# Altium schematic sheet V3(B0317).SchDoc
size A2
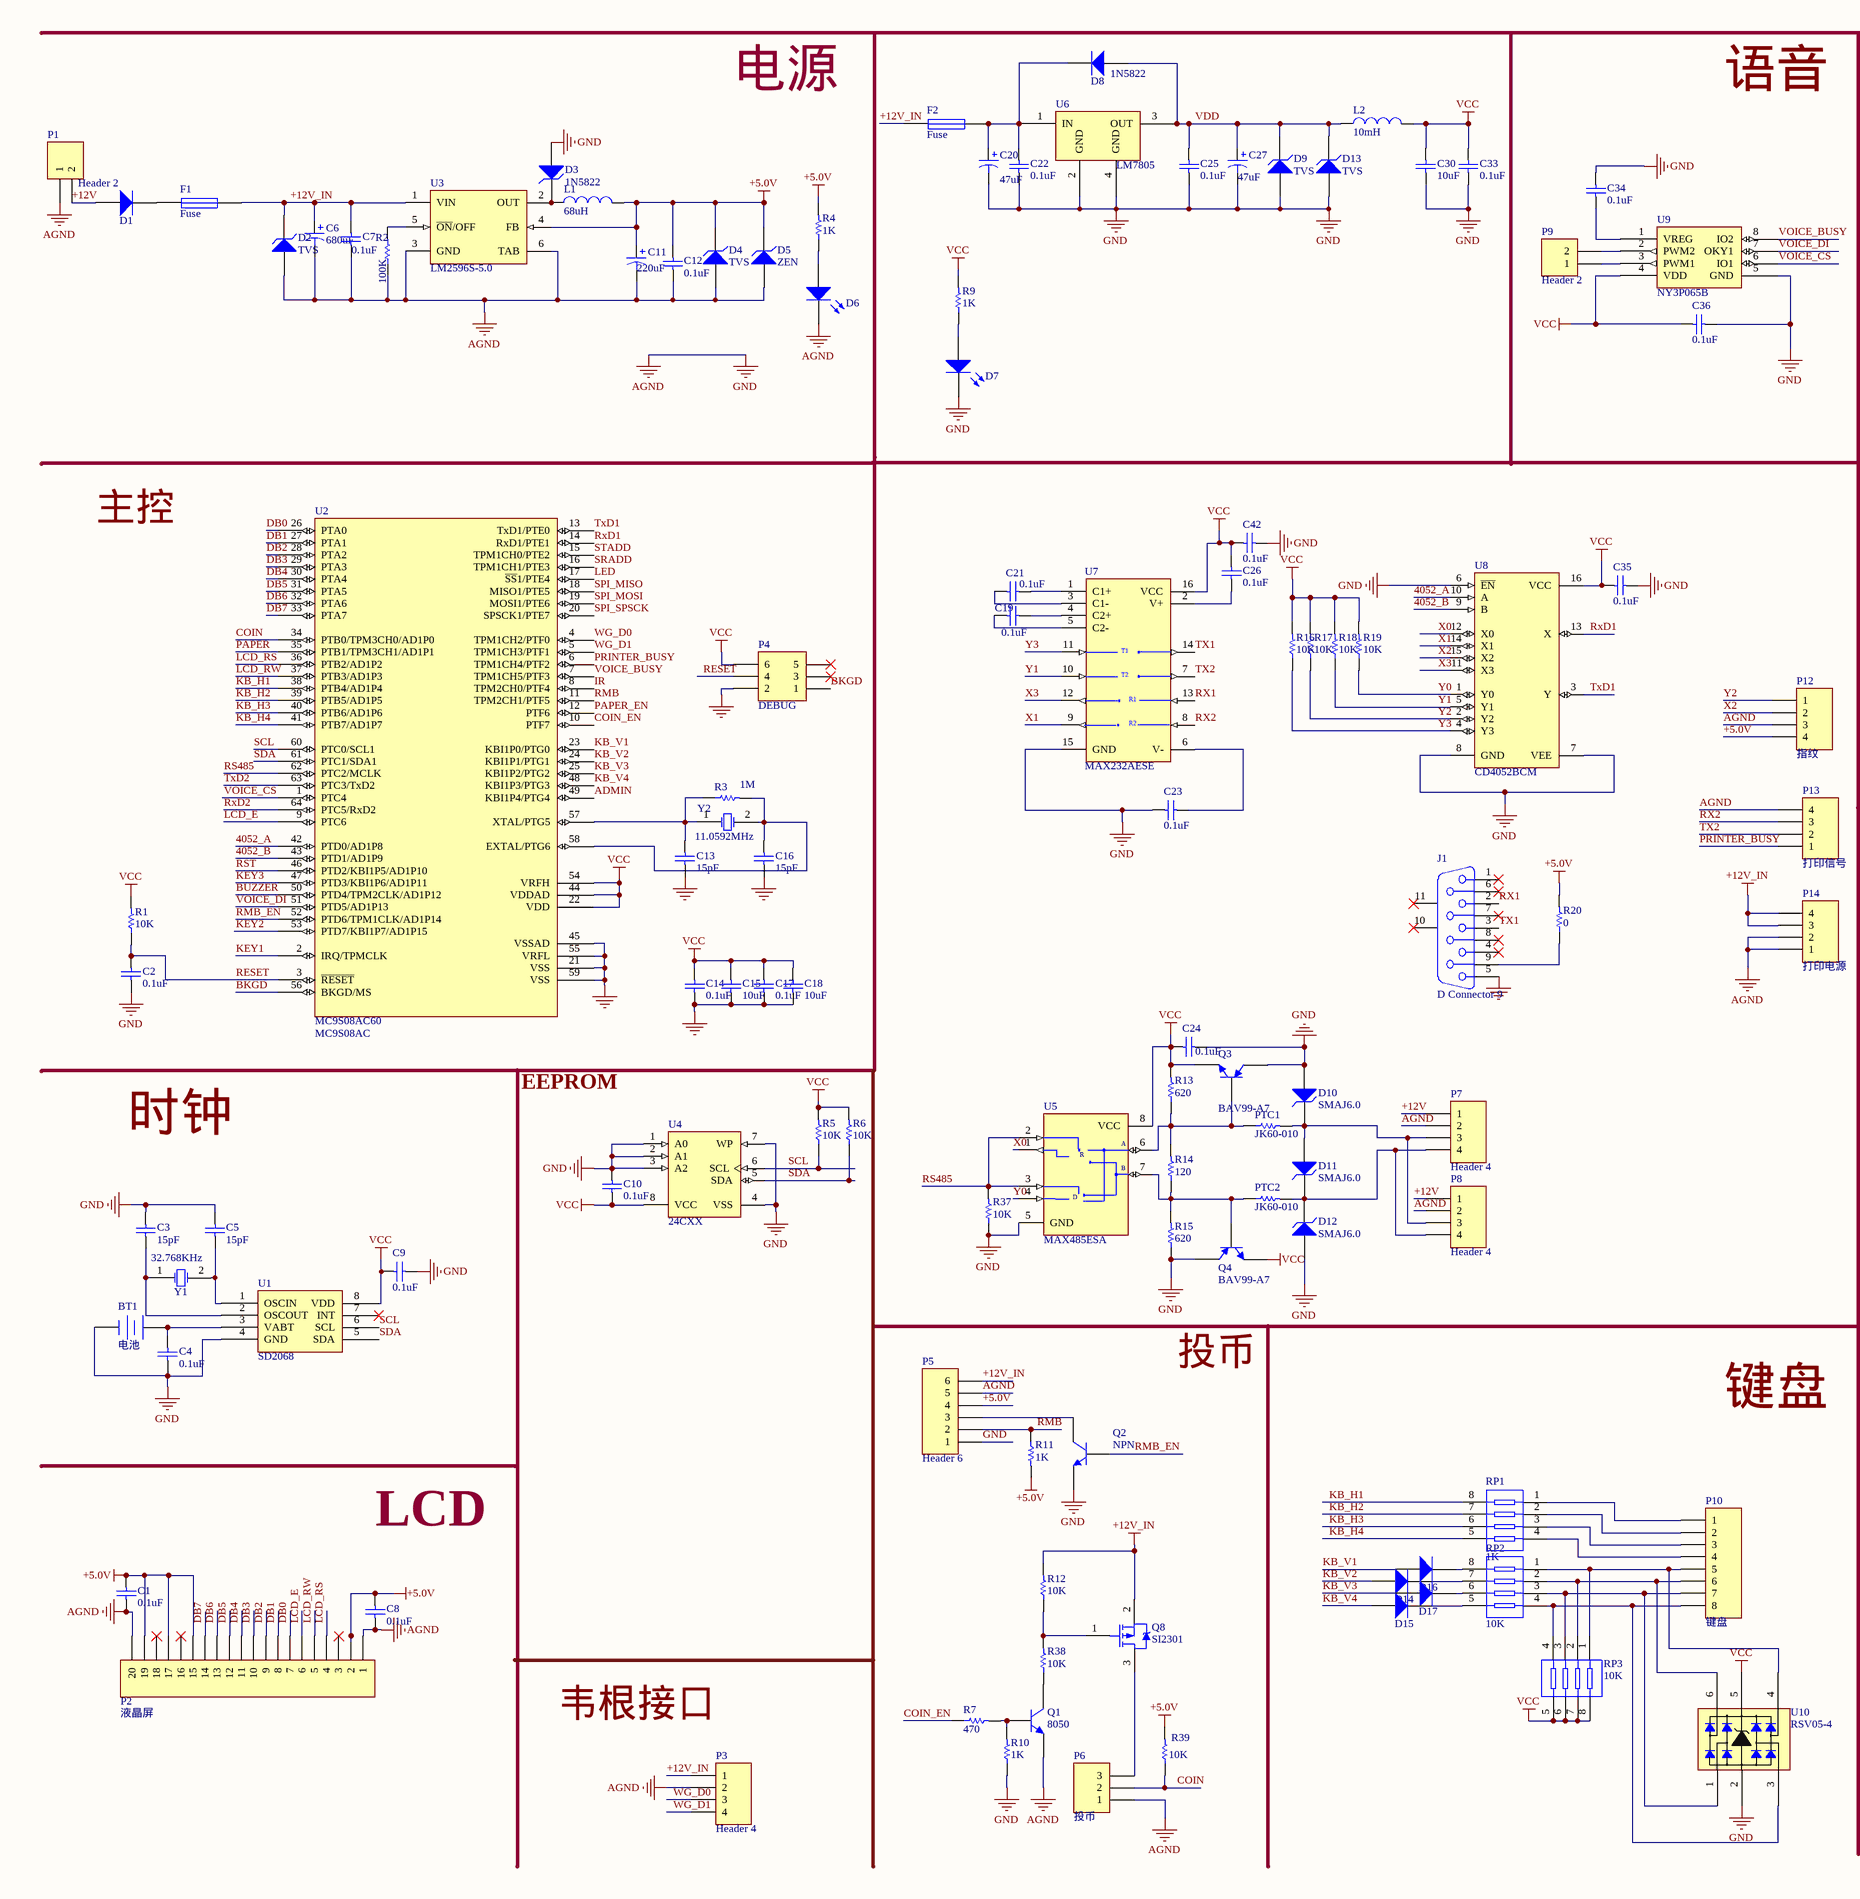
[diagram p0: V3(B0317).SchDoc, left]
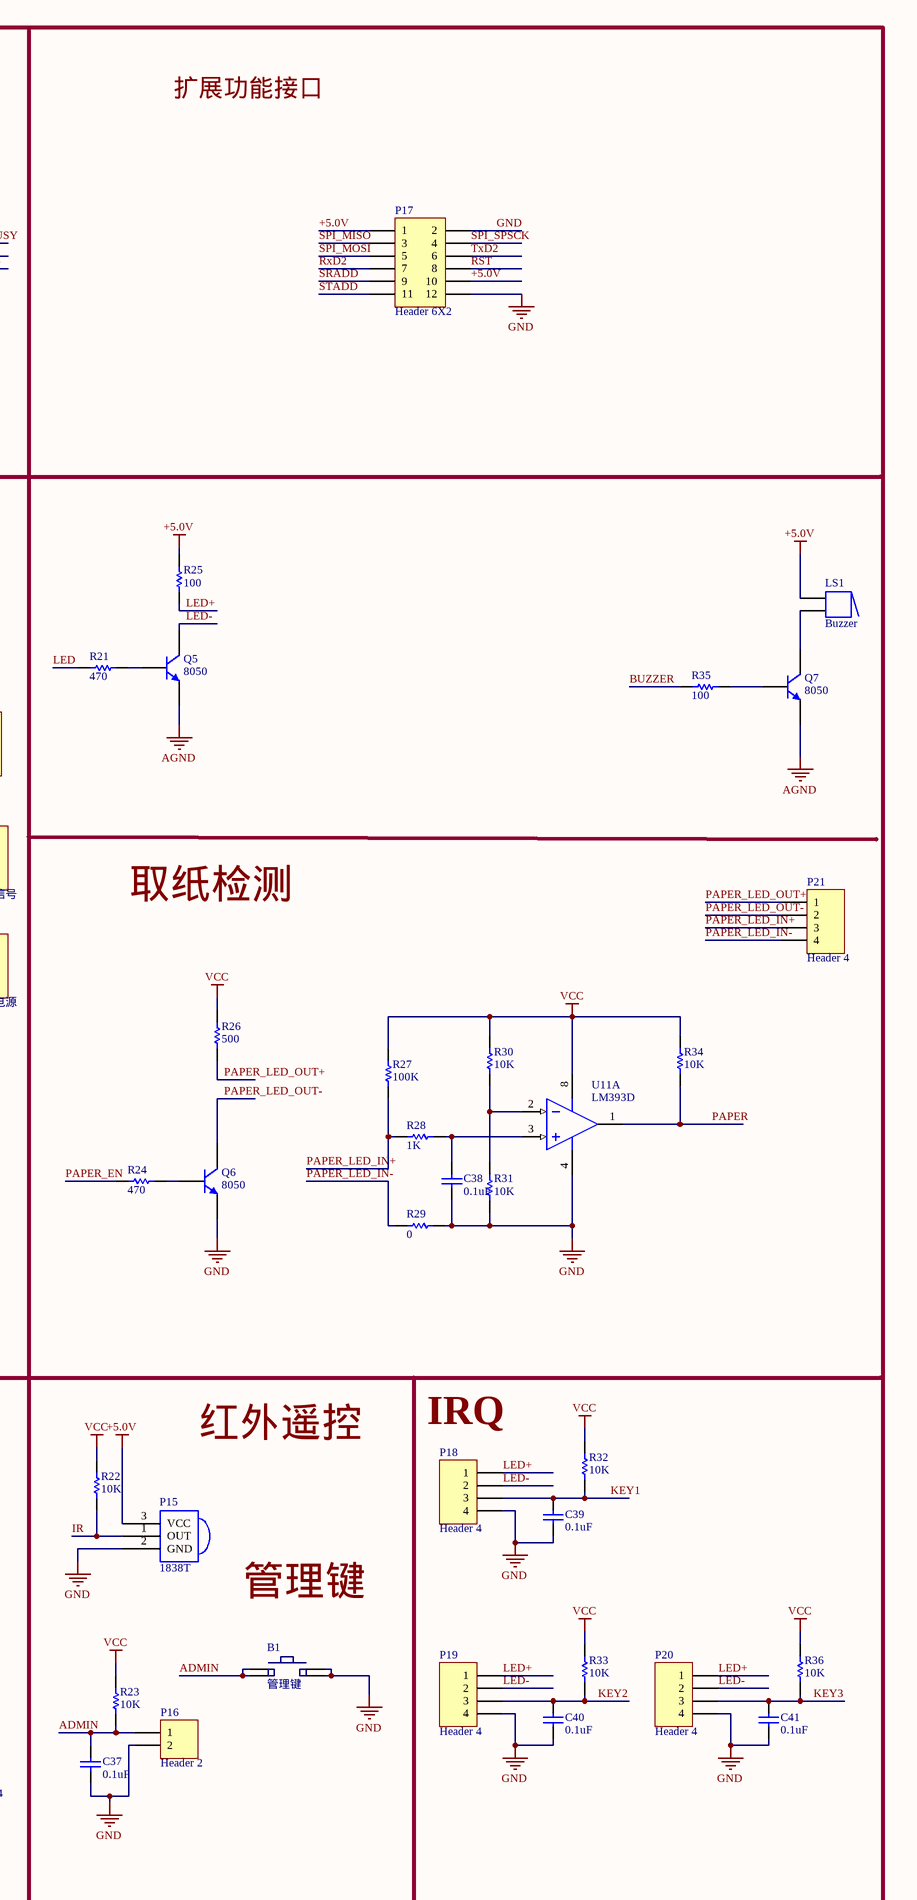
[diagram p1: V3(B0317).SchDoc, right]

## Parts
B1  管理键  [AN66]
BT1  电池  [CR1220]
C1  0.1uF  [CAPC2012M]
C2  0.1uF  [CAPC2012M]
C3  15pF  [CAPC2012M]
C4  0.1uF  [CAPC2012M]
C5  15pF  [CAPC2012M]
C6  value 680uF  [CAPPR2-5x11.5]  (hidden comment: Cap Pol2)
C7  0.1uF  [CAPC2012M]
C8  0.1uF  [CAPC2012M]
C9  0.1uF  [CAPC2012M]
C10  0.1uF  [CAPC2012M]
C11  value 220uF  [CAPPR2-5x11.5]  (hidden comment: Cap Pol2)
C12  0.1uF  [CAPC2012M]
C13  15pF  [CAPC2012M]
C14  0.1uF  [CAPC2012M]
C15  10uF  [CAPC2012M]
C16  15pF  [CAPC2012M]
C17  0.1uF  [CAPC2012M]
C18  10uF  [CAPC2012M]
C19  0.1uF  [CAPC2012M]
C20  value 47uF  [CAPPR2-5x11.5]  (hidden comment: Cap Pol2)
C21  0.1uF  [CAPC2012M]
C22  0.1uF  [CAPC2012M]
C23  0.1uF  [CAPC2012M]
C24  0.1uF  [CAPC2012M]
C25  0.1uF  [CAPC2012M]
C26  0.1uF  [CAPC2012M]
C27  value 47uF  [CAPPR2-5x11.5]  (hidden comment: Cap Pol2)
C30  10uF  [CAPC2012M]
C33  0.1uF  [CAPC2012M]
C34  0.1uF  [CAPC2012M]
C35  0.1uF  [CAPC2012M]
C36  0.1uF  [CAPC2012M]
C37  0.1uF  [CAPC2012M]
C38  0.1uF  [CAPC2012M]
C39  0.1uF  [CAPC2012M]
C40  0.1uF  [CAPC2012M]
C41  0.1uF  [CAPC2012M]
C42  0.1uF  [CAPC2012M]
D1  Diode  [DSO-C2/X1.8]  (value not drawn)
D2  TVS  [DSO-C2/X1.8]
D3  1N5822  [DSO-C2/X1.8]
D4  TVS  [DSO-C2/X1.8]
D5  ZEN  [DIO1206]
D6  LED  [LED2012M]  (value not drawn)
D7  LED  [LED2012M]  (value not drawn)
D8  1N5822  [DSO-C2/X1.8]
D9  TVS  [DSO-C2/X1.8]
D10  SMAJ6.0  [DSO-C2/X1.8]
D11  SMAJ6.0  [DSO-C2/X1.8]
D12  SMAJ6.0  [DSO-C2/X1.8]
D13  TVS  [DIO1206]
D14  1N4007  [SOD123]  (value not drawn)
D15  1N4007  [SOD123]  (value not drawn)
D16  1N4007  [SOD123]  (value not drawn)
D17  1N4007  [SOD123]  (value not drawn)
F1  Fuse  [SR075]
F2  Fuse  [FUSE1206N]
J1  D Connector 9  [DSUB1.385-2H9]
L1  value 68uH  [INDUCTOR-9*12]  (hidden comment: Inductor)
L2  value 10mH  [INDC2012M]  (hidden comment: Inductor)
LS1  Buzzer  [BELL]
P1  Header 2  [VH396-2]
P2  液晶屏  [LCD12864]
P3  Header 4  [XH254-4]
P4  DEBUG  [HDR2X3]
P5  Header 6  [XH254-6]
P6  投币  [XH254-3]
P7  Header 4  [VH396-4]
P8  Header 4  [VH396-4]
P9  Header 2  [XH254-2]
P10  键盘  [XH254-8]
P12  指纹  [XH254-4]
P13  打印信号  [XH254-4]
P14  打印电源  [XH254-4]
P15  1838T  [XH254-3]
P16  Header 2  [XH254-2]
P17  Header 6X2  [HDR2X6]
P18  Header 4  [XH254-4]
P19  Header 4  [XH254-4]
P20  Header 4  [XH254-4]
P21  Header 4  [XH254-4]
PTC1  JK60-010  [RESC2012M]
PTC2  JK60-010  [RESC2012M]
Q1  8050  [SOT23-3M]
Q2  NPN  [SOT23-3M]
Q3  BAV99-A7  [SOT23-3M]
Q4  BAV99-A7  [SOT23-3M]
Q5  8050  [SOT23-3M]
Q6  8050  [SOT23-3M]
Q7  8050  [SOT23-3M]
Q8  SI2301  [SOT23-3M]
R1  10K  [RESC2012M]
R2  100K  [RESC2012M]
R3  1M  [RESC2012M]
R4  1K  [RESC2012M]
R5  10K  [RESC2012M]
R6  10K  [RESC2012M]
R7  470  [RESC2012M]
R9  1K  [RESC2012M]
R10  1K  [RESC2012M]
R11  1K  [RESC2012M]
R12  10K  [RESC2012M]
R13  620  [RESC2012M]
R14  120  [RESC2012M]
R15  620  [RESC2012M]
R16  10K  [RESC2012M]
R17  10K  [RESC2012M]
R18  10K  [RESC2012M]
R19  10K  [RESC2012M]
R20  0  [RESC2012M]
R21  470  [RESC2012M]
R22  10K  [RESC2012M]
R23  10K  [RESC2012M]
R24  470  [RESC2012M]
R25  100  [RESC2012M]
R26  500  [RESC2012M]
R27  100K  [RESC2012M]
R28  1K  [RESC2012M]
R29  0  [RESC2012M]
R30  10K  [RESC2012M]
R31  10K  [RESC2012M]
R32  10K  [RESC2012M]
R33  10K  [RESC2012M]
R34  10K  [RESC2012M]
R35  100  [RESC2012M]
R36  10K  [RESC2012M]
R37  10K  [RESC2012M]
R38  10K  [RESC2012M]
R39  10K  [RESC2012M]
RP1  1K  [EXB38V]
RP2  10K  [EXB38V]
RP3  10K  [EXB38V]
U1  SD2068  [SO8_M]
U2  MC9S08AC60  value MC9S08AC  [QFP80P1720X1720-64N]
U3  LM2596S-5.0  [TS5B_N]
U4  24CXX  [SO8_M]
U5  MAX485ESA  [SO8_M]
U6  LM7805  [SOT223-4M]
U7  MAX232AESE  [SO16_M]
U8  CD4052BCM  [SO16_M]
U9  NY3P065B  [DIP-8]
U10  RSV05-4  [SOT26A-6M]
U11  LM393D  [SO8_M]  (part A of 2)
Y1  value 32.768KHz  [XTAL-W2/D2.1]  (hidden comment: XTAL)
Y2  value 11.0592MHz  [HC49_TH]  (hidden comment: XTAL)

## Nets
+5.0V: C1.2 C8.2 C11.1 C12.2 D4.2(K) D5.2(K) L1.2 LS1.1 P2.2 P2.15 P2.17 P2.19 P5.4 P12.4 P15.3(VCC) P17.1 P17.10 R4.2 R11.2 R20.2 R25.2 R39.2 U3.4(FB)
+12V_IN: C6.1 C7.2 D2.2(K) F1.2 F2.1 P3.1 P5.6 P14.3 P14.4 Q8.2(S) R12.2 U3.1(VIN)
AGND: B1.2 B1.4 BT1.2(-) C1.1 C2.1 C3.2 C4.1 C5.2 C6.2 C7.1 C8.1 C9.2 C10.2 C11.2 C12.1 C13.1 C14.1 C15.1 C16.1 C17.1 C18.1 C20.2 C22.1 C23.1 C24.2 C25.2 C27.2 C30.1 C33.1 C34.2 C35.2 C36.1 C37.1 C38.1 C39.1 C40.1 C41.1 C42.2 D2.1(A) D3.1(A) D4.1(A) D5.1(A) D6.2(K) D7.2(K) D9.1(A) D10.1(A) D12.1(A) D13.1(A) J1.5 P1.1 P2.1 P2.20 P3.2 P4.2 P5.1 P5.5 P6.1 P7.2 P8.2 P12.3 P13.4 P14.1 P14.2 P15.2(GND) P16.2 P17.2 P17.12 P18.4 P19.4 P20.4 Q1.2(E) Q2.2(E) Q3.1(C) Q4.1(C) Q5.2(E) Q6.2(E) Q7.2(E) R2.1 R10.1 R15.1 R29.2 R31.1 R37.1 U1.4(GND) U2.21(VSS) U2.45(VSSAD) U2.55(VRFL) U2.59(VSS) U3.3(GND) U3.6(TAB) U4.1(A0) U4.2(A1) U4.3(A2) U4.4(VSS) U4.7(WP) U5.5(GND) U6.2(GND) U6.4(GND) U7.15(GND) U8.6(~{EN}) U8.7(VEE) U8.8(GND) U9.5(GND) U10.2 U11.4(V-)  [also labelled GND]
VCC: C9.1 C10.1 C14.2 C15.2 C17.2 C18.2 C24.1 C26.2 C30.2 C33.2 C35.1 C36.2 C42.1 L2.2 P4.6 Q3.2(E) Q4.2(E) R1.2 R5.2 R6.2 R9.2 R13.2 R16.2 R17.2 R18.2 R19.2 R22.2 R23.2 R26.2 R27.2 R30.2 R32.2 R33.2 R34.2 R36.2 RP3.5 RP3.6 RP3.7 RP3.8 U1.8(VDD) U2.22(VDD) U2.44(VDDAD) U2.54(VRFH) U4.8(VCC) U5.8(VCC) U7.16(VCC) U8.16(VCC) U9.4(VDD) U10.5 U11.8(V+)
4052_A: U2.42(PTD0/AD1P8) U8.10(A)
4052_B: U2.43(PTD1/AD1P9) U8.9(B)
+12V: D1.1(A) P1.2 P7.1 P8.1
ADMIN: B1.1 B1.3 C37.2 P16.1 R23.1 U2.49(KBI1P4/PTG4)
BKGD: P4.1 U2.56(BKGD/MS)
BUZZER: R35.1 U2.50(PTD4/TPM2CLK/AD1P12)
COIN: P6.2 R39.1 U2.34(PTB0/TPM3CH0/AD1P0)
COIN_EN: R7.1 U2.10(PTF7)
DB0: P2.7 U2.26(PTA0)
DB1: P2.8 U2.27(PTA1)
DB2: P2.9 U2.28(PTA2)
DB3: P2.10 U2.29(PTA3)
DB4: P2.11 U2.30(PTA4)
DB5: P2.12 U2.31(PTA5)
DB6: P2.13 U2.32(PTA6)
DB7: P2.14 U2.33(PTA7)
IR: P15.1(OUT) R22.1 U2.8(TPM2CH0/PTF4)
KB_H1: RP1.8 U2.38(PTB4/AD1P4)
KB_H2: RP1.7 U2.39(PTB5/AD1P5)
KB_H3: RP1.6 U2.40(PTB6/AD1P6)
KB_H4: RP1.5 U2.41(PTB7/AD1P7)
KB_V1: D16.1(A) U2.23(KBI1P0/PTG0)
KB_V2: D14.1(A) U2.24(KBI1P1/PTG1)
KB_V3: D17.1(A) U2.25(KBI1P2/PTG2)
KB_V4: D15.1(A) U2.48(KBI1P3/PTG3)
KEY1: C39.2 P18.3 R32.1 U2.2(IRQ/TPMCLK)
KEY2: C40.2 P19.3 R33.1 U2.53(PTD7/KBI1P7/AD1P15)
KEY3: C41.2 P20.3 R36.1 U2.47(PTD3/KBI1P6/AD1P11)
LCD_E: P2.6 U2.9(PTC6)
LCD_RS: P2.4 U2.36(PTB2/AD1P2)
LCD_RW: P2.5 U2.37(PTB3/AD1P3)
LED: R21.1 U2.17(~{SS}1/PTE4)
LED+: P18.1 P19.1 P20.1 R25.1
LED-: P18.2 P19.2 P20.2 Q5.3(C)
PAPER: R34.1 U2.35(PTB1/TPM3CH1/AD1P1) U11.1(OUT)
PAPER_EN: R24.1 U2.12(PTF6)
PAPER_LED_IN+: P21.3 R27.1 R28.1
PAPER_LED_IN-: P21.4 R29.1
PAPER_LED_OUT+: P21.1 R26.1
PAPER_LED_OUT-: P21.2 Q6.3(C)
PRINTER_BUSY: P13.1 U2.6(TPM1CH4/PTF2)
RESET: C2.2 P4.4 R1.1 U2.3(~{RESET})
RMB: P5.2 R11.1 U2.11(TPM2CH1/PTF5)
RMB_EN: Q2.1(B) U2.52(PTD6/TPM1CLK/AD1P14)
RS485: R37.2 U2.62(PTC2/MCLK) U5.2(~{RE}) U5.3(DE)
RST: P17.8 U2.46(PTD2/KBI1P5/AD1P10)
RX1: J1.2 U7.13(R1IN)
RX2: P13.3 U7.8(R2IN)
RxD1: U2.14(RxD1/PTE1) U8.13(X)
RxD2: P17.7 U2.64(PTC5/RxD2)
SCL: R5.1 U1.6(SCL) U2.60(PTC0/SCL1) U4.6(SCL)
SDA: R6.1 U1.5(SDA) U2.61(PTC1/SDA1) U4.5(SDA)
SPI_MISO: P17.3 U2.18(MISO1/PTE5)
SPI_MOSI: P17.5 U2.19(MOSI1/PTE6)
SPI_SPSCK: P17.4 U2.20(SPSCK1/PTE7)
SRADD: P17.9 U2.16(TPM1CH1/PTE3)
STADD: P17.11 U2.15(TPM1CH0/PTE2)
TX1: J1.3 U7.14(T1OUT)
TX2: P13.2 U7.7(T2OUT)
TxD1: U2.13(TxD1/PTE0) U8.3(Y)
TxD2: P17.6 U2.63(PTC3/TxD2)
VDD: C25.1 C27.1 D8.1(A) D9.2(K) D13.2(K) L2.1 U6.3(OUT)
VOICE_BUSY: U2.7(TPM1CH5/PTF3) U9.8(IO2)
VOICE_CS: U2.1(PTC4) U9.6(IO1)
VOICE_DI: U2.51(PTD5/AD1P13) U9.7(OKY1)
WG_D0: P3.3 U2.4(TPM1CH2/PTF0)
WG_D1: P3.4 U2.5(TPM1CH3/PTF1)
X0: U5.1(RO) U8.12(X0)
X1: U7.9(R2OUT) U8.14(X1)
X2: P12.2 U8.15(X2)
X3: U7.12(R1OUT) U8.11(X3)
Y0: R19.1 U5.4(DI) U8.1(Y0)
Y1: R18.1 U7.10(T2IN) U8.5(Y1)
Y2: P12.1 R17.1 U8.2(Y2)
Y3: R16.1 U7.11(T1IN) U8.4(Y3)
NetBT1_1: BT1.1(+) C4.2 U1.3(VABT)
NetC3_1: C3.1 U1.2(OSCOUT) Y1.1(OSC1)
NetC5_1: C5.1 U1.1(OSCIN) Y1.2(OSC2)
NetC13_2: C13.2 R3.1 U2.57(XTAL/PTG5) Y2.1(OSC1)
NetC16_2: C16.2 R3.2 U2.58(EXTAL/PTG6) Y2.2(OSC2)
NetC19_1: C19.1 U7.5(C2-)
NetC19_2: C19.2 U7.4(C2+)
NetC20_1: C20.1 C22.2 D8.2(K) F2.2 U6.1(IN)
NetC21_1: C21.1 U7.3(C1-)
NetC21_2: C21.2 U7.1(C1+)
NetC23_2: C23.2 U7.6(V-)
NetC26_1: C26.1 U7.2(V+)
NetC34_1: C34.1 U9.1(VREG)
NetC38_2: C38.2 R28.2 U11.3(IN+)
NetD1_2: D1.2(K) F1.1
NetD3_2: D3.2(K) L1.1 U3.2(OUT)
NetD6_1: D6.1(A) R4.1
NetD7_1: D7.1(A) R9.1
NetD10_2: D10.2(K) D11.1(A) P7.3 P8.3 PTC1.2
NetD11_2: D11.2(K) D12.2(K) P7.4 P8.4 PTC2.2
NetD14_2: D14.2(K) RP2.7
NetD15_2: D15.2(K) RP2.5
NetD16_2: D16.2(K) RP2.8
NetD17_2: D17.2(K) RP2.6
NetJ1_9: J1.9 R20.1
NetLS1_2: LS1.2 Q7.3(C)
NetP5_3: P5.3 Q2.3(C)
NetP6_3: P6.3 Q8.3(D)
NetP9_1: P9.1 U9.3(PWM1)
NetP9_2: P9.2 U9.2(PWM2)
NetP10_1: P10.1 RP1.1
NetP10_2: P10.2 RP1.2
NetP10_3: P10.3 RP1.3
NetP10_4: P10.4 RP1.4
NetP10_5: P10.5 RP2.1 RP3.1 U10.4
NetP10_6: P10.6 RP2.2 RP3.2 U10.6
NetP10_7: P10.7 RP2.3 RP3.3 U10.1
NetP10_8: P10.8 RP2.4 RP3.4 U10.3
NetPTC1_1: PTC1.1 Q3.3(B) R13.1 R14.2 U5.6(A)
NetPTC2_1: PTC2.1 Q4.3(B) R14.1 R15.2 U5.7(B)
NetQ1_1: Q1.1(B) R7.2 R10.2
NetQ1_3: Q1.3(C) R38.1
NetQ5_1: Q5.1(B) R21.2
NetQ6_1: Q6.1(B) R24.2
NetQ7_1: Q7.1(B) R35.2
NetQ8_1: Q8.1(G) R12.1 R38.2
NetR2_2: R2.2 U3.5(~{ON}/OFF)
NetR30_1: R30.1 R31.2 U11.2(IN-)

Not connected (* = marked no-connect by the designer): J1 1* 4* 6* 7* 8* 10(MH1)* 11(MH2)*; P2 3* 16* 18*; P4 3* 5*; U1 7(INT)*

## Notes on the sheet
- 电源
- 语音
- 扩展功能接口
- 主控
- 取纸检测
- 时钟
- EEPROM
- 投币
- (near P18) IRQ
- 键盘
- 红外遥控
- LCD
- 管理键
- 韦根接口
- (in symbol MAX232AESE) T1; T2; R1; R2
- (in symbol MAX485ESA) R; D

## Library data of the parts
B1 = Button
BT1 = Battery: Multicell Battery; Published: 24-Mar-1999; LatestRevisionDate: 17-Jul-2002; LatestRevisionNote: Re-released for DXP Platform.; PackageReference: BAT-2; Publisher: Altium Limited; PackageDescription: Battery; 2 Leads
C1-C5 C7-C10 C12-C19 C21-C26 C30 C33-C42 = Cap: Capacitor; Published: 8-Jun-2000; LatestRevisionDate: 17-Jul-2002; LatestRevisionNote: Re-released for DXP Platform.; PackageReference: RAD-0.3; Publisher: Altium Limited; PackageDescription: Radial Cap, Thru-Hole; 2 Leads; 0.3 in Pin Spacing
  C1 C2 C4 C7-C10 C12 C14 C17 C19 C21-C26 C33-C42: Value: 0.1uF
  C3 C5 C13 C16: Value: 15pF
  C15 C18 C30: Value: 10uF
C6 C11 C20 C27 = Cap Pol2: Polarized Capacitor (22uf-47uf); Published: 8-Jun-2000; LatestRevisionDate: 17-Jul-2002; LatestRevisionNote: Re-released for DXP Platform.; Publisher: Altium Limited; PackageDescription: Polarized Capacitor; 2 Leads
D1 D8 D14-D17 = Diode: Default Diode; Published: 8-Jun-2000; LatestRevisionDate: 17-Jul-2002; LatestRevisionNote: Re-released for DXP Platform.; PackageVersion: Sep-1996; PackageReference: SMC; Publisher: Altium Limited; PackageDescription: DO-214-AB/SMC; 2 C-Bend Leads; Body 7.9 x 5.9 mm, inc. leads (LxW); Code_JEDEC: DO-214-AB
  D8: Value: 1N5822
  D14-D17: Value: 1N4007
D2-D5 D9-D13 = TVS: TVS瞬态抑制二极管; Published: 8-Jun-2000; LatestRevisionDate: 17-Jul-2002; LatestRevisionNote: Re-released for DXP Platform.; PackageReference: DIODE-0.7; Publisher: Altium Limited; PackageDescription: Diode, Thru-Hole; 2 Leads; 0.7 in Pin Spacing
D6 D7 = LED: Typical INFRARED GaAs LED; Published: 8-Jun-2000; LatestRevisionDate: 08-Jul-2005; LatestRevisionNote: Mech Layer 1 removed.; PackageReference: LED-0; Publisher: Altium Limited; PackageDescription: LED; 2 Leads
J1 = D Connector 9: Receptacle Assembly, 9 Position, Right Angle; PackageDocument: O; Positions: 9; Published: 15-Jun-2001; LatestRevisionDate: 17-Jul-2002; LatestRevisionNote: Re-released for DXP Platform.; DatasheetDocument: 1-Sep-1999; PackageReference: 788750; Publisher: Altium Limited; Orientation: Right Angle; Gender: Receptacle
L1 L2 = Inductor: Code_IEC: 1005; Published: 8-Jun-2000; LatestRevisionDate: 29-May-2009; LatestRevisionNote: IPC-7351 Footprint Added.; PackageReference: 0402-A; Publisher: Altium Limited; PackageDescription: Chip Inductor; Code_JEITA: 0402
LS1 = Buzzer: Magnetic Transducer Buzzer; Published: 24-Mar-1999; LatestRevisionDate: 17-Dec-2003; LatestRevisionNote: Schematic revised, PCB Footprint replaced.; DatasheetVersion: 17-Dec-2003; PackageReference: ABSM-1574; Publisher: Altium Limited; PackageDescription: Magnetic Transducer Buzzer; ComponentLink1Description: Manufacturer Link; ComponentLink1URL: http://www.megastar.com/linecard/buzzmode/index.php
P1 P9 P16 = Header 2: Header, 2-Pin; LatestRevisionDate: 17-Jul-2002; LatestRevisionNote: Re-released for DXP Platform.; Publisher: Altium Limited
P2 = Header 20: Header, 20-Pin; LatestRevisionDate: 17-Jul-2002; LatestRevisionNote: Re-released for DXP Platform.; Publisher: Altium Limited
P3 P7 P8 P12-P14 P18-P21 = Header 4: Header, 4-Pin; LatestRevisionDate: 17-Jul-2002; LatestRevisionNote: Re-released for DXP Platform.; Publisher: Altium Limited
P4 = Header 3X2: Header, 3-Pin, Dual row; LatestRevisionDate: 17-Jul-2002; LatestRevisionNote: Re-released for DXP Platform.; Publisher: Altium Limited
P5 = Header 6: Header, 6-Pin; LatestRevisionDate: 17-Jul-2002; LatestRevisionNote: Re-released for DXP Platform.; Publisher: Altium Limited
P6 = Header 3: Header, 3-Pin; LatestRevisionDate: 17-Jul-2002; LatestRevisionNote: Re-released for DXP Platform.; Publisher: Altium Limited
P10 = Header 8: Header, 8-Pin; LatestRevisionDate: 17-Jul-2002; LatestRevisionNote: Re-released for DXP Platform.; Publisher: Altium Limited
P17 = Header 6X2: Header, 6-Pin, Dual row; LatestRevisionDate: 17-Jul-2002; LatestRevisionNote: Re-released for DXP Platform.; Publisher: Altium Limited
PTC1 PTC2 R1-R7 R9-R39 = Res: Resistor; Published: 8-Jun-2000; LatestRevisionDate: 17-Jul-2002; LatestRevisionNote: Re-released for DXP Platform.; PackageReference: AXIAL-0.3; Publisher: Altium Limited; PackageDescription: Axial Device, Thru-Hole; 2 Leads; 0.3 in Pin Spacing
  PTC1 PTC2: Value: JK60-010
  R1 R5 R6 R12 R16-R19 R22 R23 R30-R34 R36-R39: Value: 10K
  R2 R27: Value: 100K
  R3: Value: 1M
  R4 R9-R11 R28: Value: 1K
  R7 R21 R24: Value: 470
  R13 R15: Value: 620
  R14: Value: 120
  R20 R29: Value: 0
  R25 R35: Value: 100
  R26: Value: 500
Q1 Q2 Q5-Q7 = NPN: NPN Bipolar Transistor; Published: 8-Jun-2000; LatestRevisionDate: 17-Jul-2002; LatestRevisionNote: Re-released for DXP Platform.; PackageReference: TO-226-AA; Publisher: Altium Limited; PackageDescription: TO, Flat Index; 3 In-Line, Axial Leads; Body Dia. 4.8mm; Leads 0.55 x 0.51 mm (max); Code_JEDEC: TO-226-AA
RP1-RP3 = Res Pack
  RP1: Value: 1K
  RP2 RP3: Value: 10K
U1 = SD2068: 实时时钟
U2 = MC9S08AC60: HCS08 MC9S08AC60
U3 = LM2596S-5.0: SIMPLE SWITCHER?Power Converter 150 KHz 3A Step-Down Voltage Regulator, 5-pin TO-263; Manufacturer: National Semiconductor; PackageTopMarking: NSUZXYTTE#*LM2596S*-5.0 P+; PowerWise: N; Published: 4-Dec-2008; DatasheetVersion: May-2002; PackageVersion: revD, Apr-2005; PackageReference: TS5B; Publisher: Altium Limited; PackageDescription: TO-263, Molded, .400 x .390 x .180in, 5 Lead, .067in Pitch, Surface Mount; Supplier 1: Farnell; Supplier Part Number 1: 1214546; PartNumber: LM2596S-5.0; RoHS: N; PinCount: 5; CompType: Switcher; Code_JEDEC: MO-169-AB; ComponentLink1Description: LM2596 Datasheet; ComponentLink1URL: http://www.national.com/ds/LM/LM2596.pdf; ComponentLink2Description: LM2596 Web Page; ComponentLink2URL: http://www.national.com/pf/LM/LM2596.html; ComponentLink3Description: TS5B Package Page; ComponentLink3URL: http://www.national.com/packaging/folders/ts5b.html
U4 = 24CXX: 5V, I2C Serial EEPROM; Published: 29-Jan-2009; DatasheetVersion: revJ, Aug-2008; PackageVersion: revBB, Aug-2009; PackageReference: SOIC-SN8; Publisher: Altium Limited; PackageDescription: 8-Lead Plastic Small Outline (SN) - Narrow, 3.90mm Body [SOIC]; Supplier 1: Digi-Key; Supplier Part Number 1: 24C02C-E/SN-ND; Code_JEDEC: MS-012; Code_IPC: SOIC127P600-8; ComponentLink1Description: Datasheet; ComponentLink1URL: http://ww1.microchip.com/downloads/en/DeviceDoc/21202J.pdf; ComponentLink2Description: Packaging Specification; ComponentLink2URL: http://www.microchip.com/stellent/groups/techpub_sg/documents/packagingspec/en012702.pdf; ComponentLink3Description: Microchip.com Home; ComponentLink3URL: http://www.microchip.com/
U5 = MAX485ESA: Low-Power, Slew-Rate-Limited RS-485/RS-422 Transceiver; Published: 16-Jan-2001; LatestRevisionDate: 13-Apr-2006; LatestRevisionNote: IPC-7351 Footprint Added.; DatasheetVersion: Feb-1996; PackageReference: NSO8; Publisher: Altium Limited; PackageDescription: 8-Pin Small Outline Integrated Circuit 1.27 mm Pitch; Code_JEDEC: MS-012-AA; Code_IPC: SOIC127P600-8; ComponentLink1Description: Manufacturer Link; ComponentLink1URL: http://www.maxim-ic.com/; ComponentLink2Description: Datasheet; ComponentLink2URL: http://pdfserv.maxim-ic.com/en/ds/MAX1487-MAX491.pdf
U7 = MAX232AESE: +5V-Powered, Multichannel RS-232 Driver/Receiver; Published: 16-Jan-2001; LatestRevisionDate: 13-Apr-2006; LatestRevisionNote: IPC-7351 Footprint Added.; DatasheetVersion: Nov-1997; PackageReference: NSO16; Publisher: Altium Limited; PackageDescription: 16-Pin Small Outline Integrated Circuit 1.27 mm Pitch; Code_JEDEC: MS-012-AC; Code_IPC: SOIC127P600-16; ComponentLink1Description: Manufacturer Link; ComponentLink1URL: http://www.maxim-ic.com/; ComponentLink2Description: Datasheet; ComponentLink2URL: http://pdfserv.maxim-ic.com/en/ds/MAX220-MAX249.pdf
U8 = CD4052BCM: Dual 4-Channel Analog Multiplexer/Demultiplexer; Published: 17-Jul-2002; LatestRevisionDate: 13-Apr-2006; LatestRevisionNote: IPC-7351 Footprint Added.; DatasheetVersion: Jan-1999; PackageVersion: 2000; PackageReference: M16A; Publisher: Altium Limited; PackageDescription: 16-Pin Small Outline Integrated Circuit 1.27 mm Pitch; Code_IPC: SOIC127P600-16; ComponentLink1Description: Manufacturer Link; ComponentLink1URL: http://www.fairchildsemi.com/; ComponentLink2Description: Datasheet; ComponentLink2URL: http://www.fairchildsemi.com/ds/CD%2FCD4052BC.pdf
U10 = RSV05-4: USB OR  Ethernet ESD
U11 = LM393D: Low-Power Dual Voltage Comparator; Published: 24-Aug-2001; LatestRevisionDate: 13-Apr-2006; LatestRevisionNote: IPC-7351 Footprint Added.; DatasheetVersion: Jun-1998; PackageVersion: Dec-2002; PackageReference: SO8; Publisher: Altium Limited; PackageDescription: 8-Pin Small Outline Integrated Circuit 1.27 mm Pitch; Code_JEDEC: MS-012-AA; Code_IPC: SOIC127P600-8; ComponentLink1Description: Manufacturer Link; ComponentLink1URL: http://www.st.com/; ComponentLink2Description: Datasheet; ComponentLink2URL: http://www.st.com/stonline/products/literature/ds/2164/lm293.pdf
Y1 Y2 = XTAL: Crystal Oscillator; Published: 8-Jun-2000; LatestRevisionDate: 17-Jul-2002; LatestRevisionNote: Re-released for DXP Platform.; PackageReference: R38; Publisher: Altium Limited; PackageDescription: Crystal, Thru-Hole; 2 Leads; Body 3.1 x 8.2 mm (Dia.xH)
F1 F2 = Fuse: Published: 8-Jun-2000; LatestRevisionDate: 17-Jul-2002; LatestRevisionNote: Re-released for DXP Platform.; PackageReference: PIN-W2/E2.8; Publisher: Altium Limited; PackageDescription: Thru-Hole; 2 Leads